# Altium schematic sheet Connectors.SchDoc
size A; SheetNumber: 13
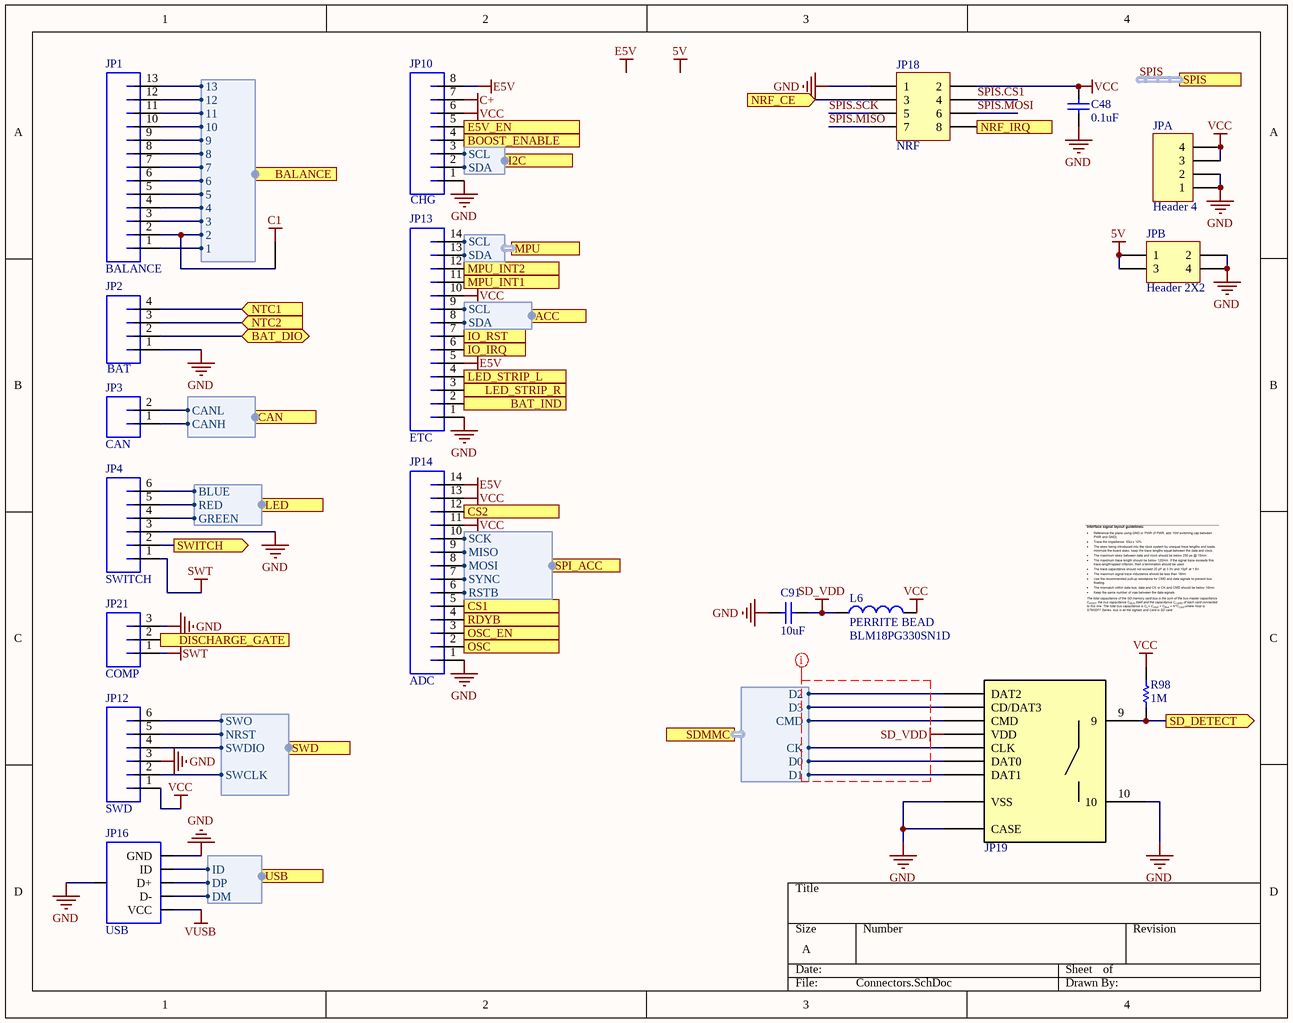
[diagram p0: Connectors.SchDoc]

## Parts
*1  NetTie  [NetTie]  (value not drawn)  (net tie, no BOM)
C48  value 0.1uF  [C0603[1608X92]]  (hidden comment: 0.1uF 6.3V 0603)
C91  value 10uF  [C0603[1608X92]]  (hidden comment: 10uF 16V 0603)
JP1  BALANCE  [JST-XH-13-PTH-VERT]
JP2  BAT  [JST-PH-4-PTH-VERT]
JP3  CAN  [JST-PH-2-PTH-HORZ]
JP4  SWITCH  [JST-PH-6-PTH-HORZ]
JP10  CHG  [JST-PH-8-PTH-HORZ]
JP12  SWD  [MOLEX_5045_6]
JP13  ETC  [JST-PH-14-PTH-HORZ]
JP14  ADC  [JST-PH-14-PTH-HORZ]
JP16  USB  [USB-MICROB_HORZ]
JP18  NRF  [HDR2X4]
JP19  MICRO SD TOP MOUNT  [MICRO SD_502570]  (value not drawn)
JP21  COMP  [JST-PH-3-PTH-HORZ]
JPA  Header 4  [HDR1X4]
JPB  Header 2X2  [HDR2X2]
L6  Type: PERRITE BEAD  PartNumber: BLM18PG330SN1D  [IND0603]  (hidden comment: 33Ohm)
R98  value 1M  [R0603[1608]]  (hidden comment: 1M 5% 0603)

## Ports
ACC (harness I2C), BALANCE (harness Balance), BAT_DIO (bidir), BAT_IND (in), BOOST_ENABLE (in), CAN (harness CAN Output), CS1 (out), CS2 (out), DISCHARGE_GATE (out), E5V_EN (in), I2C (harness I2C), IO_IRQ (out), IO_RST (in), LED (harness LED), LED_STRIP_L (in), LED_STRIP_R (in), MPU (harness I2C), MPU_INT1 (out), MPU_INT2 (out), NRF_CE (in), NRF_IRQ (out), NTC1 (in), NTC2 (in), OSC (out), OSC_EN (out), RDYB (out), SD_DETECT (out), SDMMC (harness SDMMC), SPI_ACC (harness SPI_ADC), SPIS (harness SPI), SWD (harness SWD), SWITCH (out), USB (harness USB)

## Harnesses
CAN Output: CANL, CANH
Balance: 13, 12, 11, 10, 9, 8, 6, 7, 5, 3, 4, 2, 1
I2C: SCL, SDA
SWD: SWCLK, SWDIO, SWO, NRST
LED: RED, BLUE, GREEN
SDMMC: D2, D3, CMD, CK, D0, D1
SPI_ADC: MOSI, MISO, SCK, SYNC, RSTB
USB: DM, DP, ID

## Nets
5V: JPB.1 JPB.3
C1: *1.2
C+: JP10.7
E5V: JP10.8 JP13.5 JP14.14
GND: C48.1 C91.2 JP2.1 JP4.3 JP10.1 JP12.3 JP13.1 JP14.1 JP16.GND JP16.MT1(SHIELD) JP18.1 JP19.10 JP19.CASE JP19.VSS JP21.3 JPA.1 JPA.2 JPB.2 JPB.4
SD_VDD: C91.1 JP19.VDD L6.1
SWT: JP4.1 JP21.1
VCC: C48.2 JP10.6 JP12.1 JP13.10 JP14.11 JP14.13 JP18.2 JPA.3 JPA.4 L6.2 R98.1
VUSB: JP16.VBUS(VCC)
BAT_DIO: JP2.2 ; port BAT_DIO
BAT_IND: JP13.2 ; port BAT_IND
BOOST_ENABLE: JP10.4 ; port BOOST_ENABLE
CS1: JP14.5 ; port CS1
CS2: JP14.12 ; port CS2
DISCHARGE_GATE: JP21.2 ; port DISCHARGE_GATE
E5V_EN: JP10.5 ; port E5V_EN
IO_IRQ: JP13.6 ; port IO_IRQ
IO_RST: JP13.7 ; port IO_RST
LED_STRIP_L: JP13.4 ; port LED_STRIP_L
LED_STRIP_R: JP13.3 ; port LED_STRIP_R
MPU_INT1: JP13.11 ; port MPU_INT1
MPU_INT2: JP13.12 ; port MPU_INT2
NRF_CE: JP18.3 ; port NRF_CE
NRF_IRQ: JP18.8 ; port NRF_IRQ
NTC1: JP2.4 ; port NTC1
NTC2: JP2.3 ; port NTC2
OSC: JP14.2 ; port OSC
OSC_EN: JP14.3 ; port OSC_EN
RDYB: JP14.4 ; port RDYB
SD_DETECT: JP19.9 R98.2 ; port SD_DETECT
SPIS.CS1: JP18.4
SPIS.MISO: JP18.7
SPIS.MOSI: JP18.6
SPIS.SCK: JP18.5
SWITCH: JP4.2 ; port SWITCH
Net*1_1: *1.1 JP1.2 ; port BALANCE.2
NetJP1_1: JP1.1 ; port BALANCE.1
NetJP1_3: JP1.3 ; port BALANCE.3
NetJP1_4: JP1.4 ; port BALANCE.4
NetJP1_5: JP1.5 ; port BALANCE.5
NetJP1_6: JP1.6 ; port BALANCE.6
NetJP1_7: JP1.7 ; port BALANCE.7
NetJP1_8: JP1.8 ; port BALANCE.8
NetJP1_9: JP1.9 ; port BALANCE.9
NetJP1_10: JP1.10 ; port BALANCE.10
NetJP1_11: JP1.11 ; port BALANCE.11
NetJP1_12: JP1.12 ; port BALANCE.12
NetJP1_13: JP1.13 ; port BALANCE.13
NetJP3_1: JP3.1 ; port CAN.CANH
NetJP3_2: JP3.2 ; port CAN.CANL
NetJP4_4: JP4.4 ; port LED.GREEN
NetJP4_5: JP4.5 ; port LED.RED
NetJP4_6: JP4.6 ; port LED.BLUE
NetJP10_2: JP10.2 ; port I2C.SDA
NetJP10_3: JP10.3 ; port I2C.SCL
NetJP12_2: JP12.2 ; port SWD.SWCLK
NetJP12_4: JP12.4 ; port SWD.SWDIO
NetJP12_5: JP12.5 ; port SWD.NRST
NetJP12_6: JP12.6 ; port SWD.SWO
NetJP13_8: JP13.8 ; port ACC.SDA
NetJP13_9: JP13.9 ; port ACC.SCL
NetJP13_13: JP13.13 ; port MPU.SDA
NetJP13_14: JP13.14 ; port MPU.SCL
NetJP14_6: JP14.6 ; port SPI_ACC.RSTB
NetJP14_7: JP14.7 ; port SPI_ACC.SYNC
NetJP14_8: JP14.8 ; port SPI_ACC.MOSI
NetJP14_9: JP14.9 ; port SPI_ACC.MISO
NetJP14_10: JP14.10 ; port SPI_ACC.SCK
NetJP16_D+: JP16.D+ ; port USB.DP
NetJP16_D-: JP16.D- ; port USB.DM
NetJP16_ID: JP16.ID ; port USB.ID
NetJP19_CD/DAT3: JP19.CD/DAT3 ; port SDMMC.D3
NetJP19_CLK: JP19.CLK ; port SDMMC.CK
NetJP19_CMD: JP19.CMD ; port SDMMC.CMD
NetJP19_DAT0: JP19.DAT0 ; port SDMMC.D0
NetJP19_DAT1: JP19.DAT1 ; port SDMMC.D1
NetJP19_DAT2: JP19.DAT2 ; port SDMMC.D2

## Buses and harness runs
harness SPIS = port SPIS

## Layout directives
rule Width Constraint [Pref Width = 11.55mil    Min Width = 11.55mil    Max Width = 11.55mil]; net class SD; rule Matched Net Lengths [Tolerance = 100mil]: (no net found under the mark)

## Notes on the sheet
- Labels drawn without touching a wire or pin: 5V, E5V

## Library data of the parts
C48 = CAP_0.1uF_6.3V_0603_10%: 0.1uF 6.3V 10% 0603 (1608 Metric); PartNumber: GRM188R70J104KA01D; Manufacturer: Murata; Mounting Technology: Surface Mount; PackageReference: 0603; PackageDescription: 0603 (1608 Metric); Voltage: 6.3V; Tolerance: 10%
C91 = CAP_10uF_16V_0603_10%: 10uF 16V 10% 0603 (1608 Metric); PartNumber: GRM188R61C106KAALD; Manufacturer: Murata; TemperatureCoefficient: X5R; Mounting Technology: Surface Mount; PackageReference: 0603; PackageDescription: 0603 (1608 Metric); Voltage: 16V; Tolerance: 10%
JP1 = JST_XH_13_VERT: Manufacturer: JST Sales America, Inc.; PartNumber: B13B-XH-A(LF)(SN); Mounting Technology: Through Hole; PackageReference: JST-XH
JP2 = JST_PH_4_VERT: Manufacturer: JST Sales America Inc.; PartNumber: B4B-PH-K-S(LF)(SN); Mounting Technology: Through Hole; PackageReference: JST-PH
JP3 = JST_PH_2_HORZ: Manufacturer: JST Sales America Inc.; PartNumber: B2B-PH-K-S(LF)(SN); Mounting Technology: Through Hole; PackageReference: JST-PH
JP4 = JST_PH_6_HORZ: PartNumber: S6B-PH-K-S; Manufacturer: JST Sales America Inc.; PackageReference: JST-PH; Mounting Technology: Through Hole
JP10 = JST_PH_8_HORZ: PartNumber: S8B-PH-K-S(LF)(SN); Manufacturer: JST Sales America Inc.; PackageReference: JST-PH; Mounting Technology: Through Hole
JP12 = MOLEX_5045_6: PartNumber: B6B-PH-K-S(LF)(SN); Manufacturer: JST Sales America Inc.; PackageReference: JST-PH; Mounting Technology: Through Hole
JP13 JP14 = JST_PH_14_HORZ: PartNumber: S14B-PH-K-S(LF)(SN); Manufacturer: JST Sales America Inc.; Mounting Technology: Through Hole; PackageReference: JST-PH
JP16 = USB_MICROB_HORZ: pin to pad: MT1>MT1+P$1+P$2+MT2; PartNumber: 10118192-0001LF; Manufacturer: Amphenol FCI; Mounting Technology: Surface Mount; PackageReference: USB - Micro B
JP18 = Header 4X2: Header, 4-Pin, Dual row; LatestRevisionDate: 17-Jul-2002; LatestRevisionNote: Re-released for DXP Platform.; Publisher: Altium Limited
JP19 = MICRO SD_5025: MICRO SD Slot / TOP MOUNT / FRONT; Manufacturer: Molex; PartNumber: 5025700893; Mounting Technology: SMD; PackageReference: Header-1.27mm-2x5
JP21 = JST_PH_3_HORZ: Manufacturer: JST Sales America Inc.; PartNumber: B3B-PH-K-S(LF)(SN); Mounting Technology: Through Hole; PackageReference: JST-PH
JPA = Header 4: Header, 4-Pin; LatestRevisionDate: 17-Jul-2002; LatestRevisionNote: Re-released for DXP Platform.; Publisher: Altium Limited
JPB = Header 2X2: Header, 2-Pin, Dual row; LatestRevisionDate: 17-Jul-2002; LatestRevisionNote: Re-released for DXP Platform.; Publisher: Altium Limited
L6 = PER_33Ohm_3A_0603: 33Ohm 3A 0603 Perrite Bead; Manufacturer: Murata; PackageReference: 0603; PackageDescription: 0603 (1608 metric); Mounting Technology: Surface Mount; Current: 3A; Value: 33Ohm
R98 = RES_1M_0603_5%: 1M 0.25W 5% 0603 (1005 Metric); Manufacturer: Panasonic; PartNumber: ERJ-PA3J105V; Tolerance: 5%; Power: 0.25W; Mounting Technology: Surface Mount; PackageReference: 0603; PackageDescription: 0603 (1608 Metric); ComponentLink1Description: Datasheet; ComponentLink1URL: http://www.vishay.com/docs/20043/crcwhpe3.pdf